# Altium schematic sheet P09 DDRA&B NOVTT.SchDoc
size 420 x 297 mm
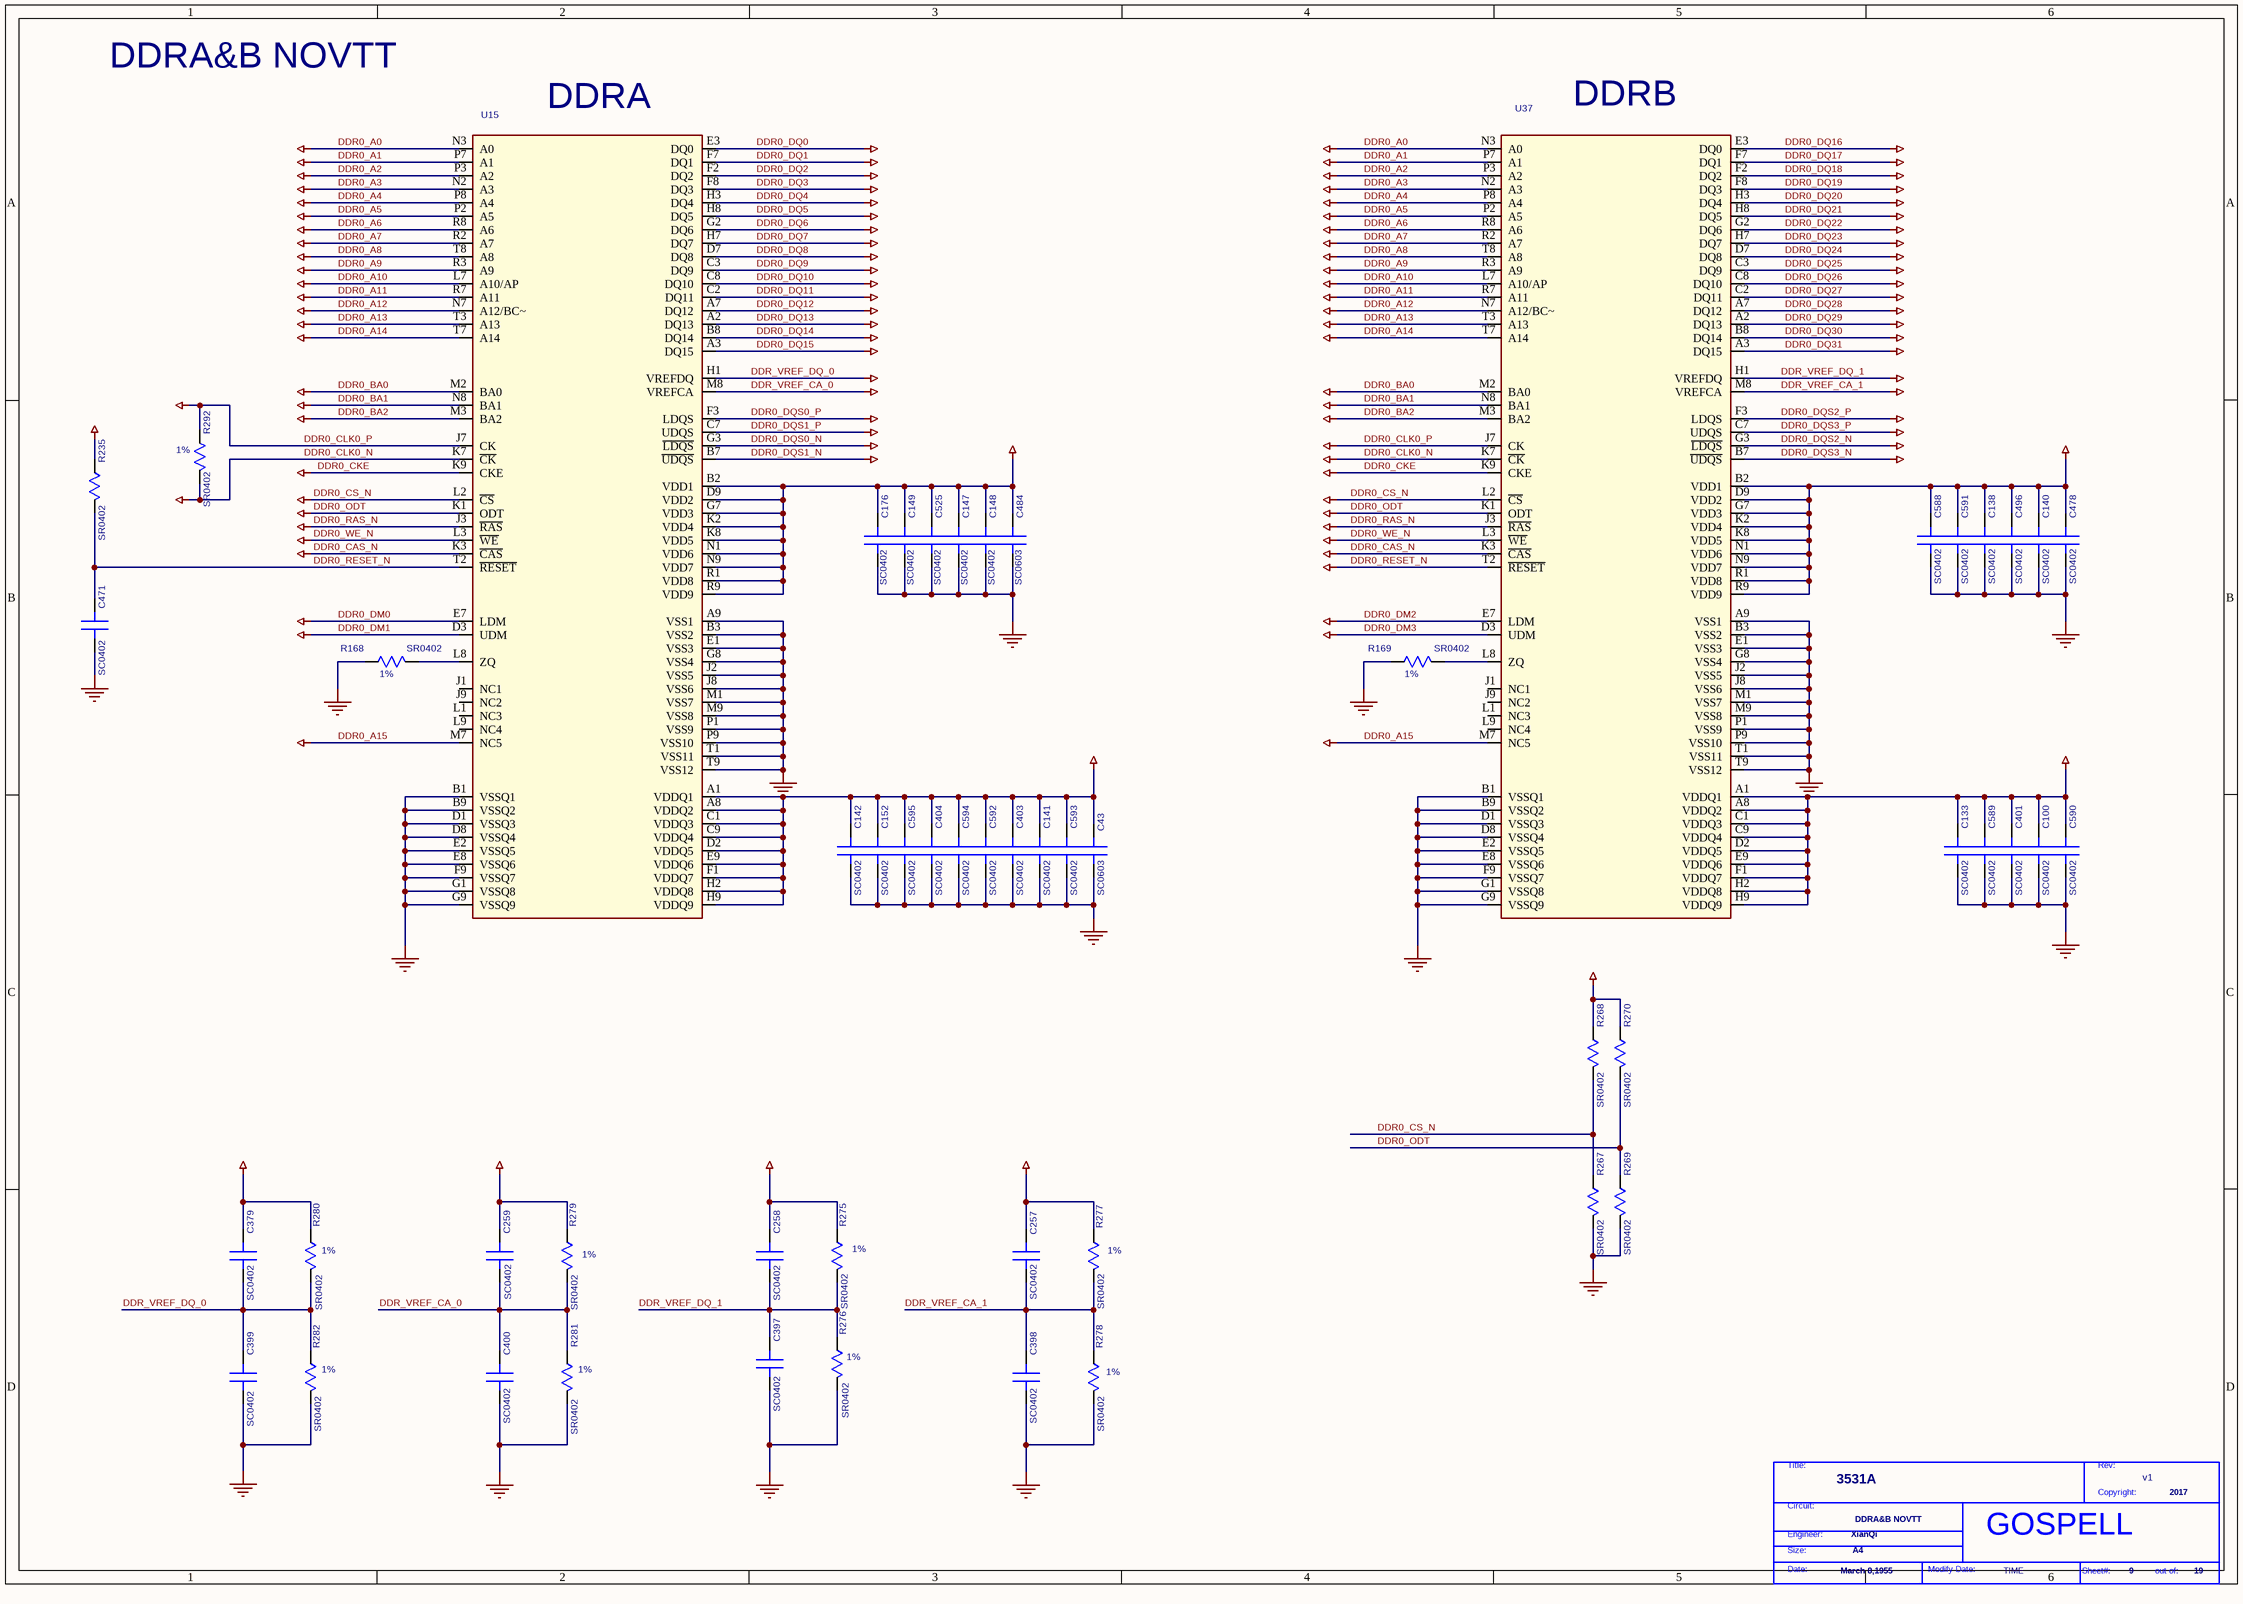
[diagram p0: P09 DDRA&B NOVTT.SchDoc]

## Parts
*  Page Modify Date: TIME  Engineer: XianQi  Copyright: 2017  Title: 3531A  RevCode: v1  Page Size: A4  Page Create Date: March 8,1955  Page Number: 9  Page Count: 19  Doc: DDRA&B NOVTT  (hidden comment: GOSPELL)  (graphical)
C43  SC0603  [SC0603]
C100  SC0402  [SC0402]
C133  SC0402  [SC0402]
C138  SC0402  [SC0402]
C140  SC0402  [SC0402]
C141  SC0402  [SC0402]
C142  SC0402  [SC0402]
C147  SC0402  [SC0402]
C148  SC0402  [SC0402]
C149  SC0402  [SC0402]
C152  SC0402  [SC0402]
C176  SC0402  [SC0402]
C257  SC0402  [SC0402]
C258  SC0402  [SC0402]
C259  SC0402  [SC0402]
C379  SC0402  [SC0402]
C397  SC0402  [SC0402]
C398  SC0402  [SC0402]
C399  SC0402  [SC0402]
C400  SC0402  [SC0402]
C401  SC0402  [SC0402]
C403  SC0402  [SC0402]
C404  SC0402  [SC0402]
C471  SC0402  [SC0402]
C478  SC0402  [SC0402]
C484  SC0603  [SC0603]
C496  SC0402  [SC0402]
C525  SC0402  [SC0402]
C588  SC0402  [SC0402]
C589  SC0402  [SC0402]
C590  SC0402  [SC0402]
C591  SC0402  [SC0402]
C592  SC0402  [SC0402]
C593  SC0402  [SC0402]
C594  SC0402  [SC0402]
C595  SC0402  [SC0402]
R168  SR0402  [SR0402]
R169  SR0402  [SR0402]
R235  SR0402  [SR0402]
R267  SR0402  [SR0402]
R268  SR0402  [SR0402]
R269  SR0402  [SR0402]
R270  SR0402  [SR0402]
R275  SR0402  [SR0402]
R276  SR0402  [SR0402]
R277  SR0402  [SR0402]
R278  SR0402  [SR0402]
R279  SR0402  [SR0402]
R280  SR0402  [SR0402]
R281  SR0402  [SR0402]
R282  SR0402  [SR0402]
R292  SR0402  [SR0402]
U15  BGA96-32-1609M  [BGA96-32-1609M]  (value not drawn)
U37  BGA96-32-1609M  [BGA96-32-1609M]  (value not drawn)

## Nets
1V5: C43.1(A) C100.1(A) C133.1(A) C138.1(A) C140.1(A) C141.1(A) C142.1(A) C147.1(A) C148.1(A) C149.1(A) C152.1(A) C176.1(A) C257.1(A) C258.1(A) C259.1(A) C379.1(A) C401.1(A) C403.1(A) C404.1(A) C478.1(A) C484.1(A) C496.1(A) C525.1(A) C588.1(A) C589.1(A) C590.1(A) C591.1(A) C592.1(A) C593.1(A) C594.1(A) C595.1(A) R235.1(A) R268.1(A) R270.1(A) R275.1(A) R277.1(A) R279.1(A) R280.1(A) U15.A1(VDDQ1) U15.A8(VDDQ2) U15.B2(VDD1) U15.C1(VDDQ3) U15.C9(VDDQ4) U15.D2(VDDQ5) U15.D9(VDD2) U15.E9(VDDQ6) U15.F1(VDDQ7) U15.G7(VDD3) U15.H2(VDDQ8) U15.H9(VDDQ9) U15.K2(VDD4) U15.K8(VDD5) U15.N1(VDD6) U15.N9(VDD7) U15.R1(VDD8) U15.R9(VDD9) U37.A1(VDDQ1) U37.A8(VDDQ2) U37.B2(VDD1) U37.C1(VDDQ3) U37.C9(VDDQ4) U37.D2(VDDQ5) U37.D9(VDD2) U37.E9(VDDQ6) U37.F1(VDDQ7) U37.G7(VDD3) U37.H2(VDDQ8) U37.H9(VDDQ9) U37.K2(VDD4) U37.K8(VDD5) U37.N1(VDD6) U37.N9(VDD7) U37.R1(VDD8) U37.R9(VDD9)
DDR0_A0: U15.N3(A0) U37.N3(A0)
DDR0_A1: U15.P7(A1) U37.P7(A1)
DDR0_A2: U15.P3(A2) U37.P3(A2)
DDR0_A3: U15.N2(A3) U37.N2(A3)
DDR0_A4: U15.P8(A4) U37.P8(A4)
DDR0_A5: U15.P2(A5) U37.P2(A5)
DDR0_A6: U15.R8(A6) U37.R8(A6)
DDR0_A7: U15.R2(A7) U37.R2(A7)
DDR0_A8: U15.T8(A8) U37.T8(A8)
DDR0_A9: U15.R3(A9) U37.R3(A9)
DDR0_A10: U15.L7(A10/AP) U37.L7(A10/AP)
DDR0_A11: U15.R7(A11) U37.R7(A11)
DDR0_A12: U15.N7(A12/BC~) U37.N7(A12/BC~)
DDR0_A13: U15.T3(A13) U37.T3(A13)
DDR0_A14: U15.T7(A14) U37.T7(A14)
DDR0_A15: U15.M7(NC5) U37.M7(NC5)
DDR0_BA0: U15.M2(BA0) U37.M2(BA0)
DDR0_BA1: U15.N8(BA1) U37.N8(BA1)
DDR0_BA2: U15.M3(BA2) U37.M3(BA2)
DDR0_CAS_N: U15.K3(~{CAS}) U37.K3(~{CAS})
DDR0_CKE: U15.K9(CKE) U37.K9(CKE)
DDR0_CLK0_N: R292.2(B) U15.K7(~{CK}) U37.K7(~{CK})
DDR0_CLK0_P: R292.1(A) U15.J7(CK) U37.J7(CK)
DDR0_CS_N: R267.1(A) R268.2(B) U15.L2(~{CS}) U37.L2(~{CS})
DDR0_DM0: U15.E7(LDM)
DDR0_DM1: U15.D3(UDM)
DDR0_DM2: U37.E7(LDM)
DDR0_DM3: U37.D3(UDM)
DDR0_DQ0: U15.E3(DQ0)
DDR0_DQ1: U15.F7(DQ1)
DDR0_DQ2: U15.F2(DQ2)
DDR0_DQ3: U15.F8(DQ3)
DDR0_DQ4: U15.H3(DQ4)
DDR0_DQ5: U15.H8(DQ5)
DDR0_DQ6: U15.G2(DQ6)
DDR0_DQ7: U15.H7(DQ7)
DDR0_DQ8: U15.D7(DQ8)
DDR0_DQ9: U15.C3(DQ9)
DDR0_DQ10: U15.C8(DQ10)
DDR0_DQ11: U15.C2(DQ11)
DDR0_DQ12: U15.A7(DQ12)
DDR0_DQ13: U15.A2(DQ13)
DDR0_DQ14: U15.B8(DQ14)
DDR0_DQ15: U15.A3(DQ15)
DDR0_DQ16: U37.E3(DQ0)
DDR0_DQ17: U37.F7(DQ1)
DDR0_DQ18: U37.F2(DQ2)
DDR0_DQ19: U37.F8(DQ3)
DDR0_DQ20: U37.H3(DQ4)
DDR0_DQ21: U37.H8(DQ5)
DDR0_DQ22: U37.G2(DQ6)
DDR0_DQ23: U37.H7(DQ7)
DDR0_DQ24: U37.D7(DQ8)
DDR0_DQ25: U37.C3(DQ9)
DDR0_DQ26: U37.C8(DQ10)
DDR0_DQ27: U37.C2(DQ11)
DDR0_DQ28: U37.A7(DQ12)
DDR0_DQ29: U37.A2(DQ13)
DDR0_DQ30: U37.B8(DQ14)
DDR0_DQ31: U37.A3(DQ15)
DDR0_DQS0_N: U15.G3(~{LDQS})
DDR0_DQS0_P: U15.F3(LDQS)
DDR0_DQS1_N: U15.B7(~{UDQS})
DDR0_DQS1_P: U15.C7(UDQS)
DDR0_DQS2_N: U37.G3(~{LDQS})
DDR0_DQS2_P: U37.F3(LDQS)
DDR0_DQS3_N: U37.B7(~{UDQS})
DDR0_DQS3_P: U37.C7(UDQS)
DDR0_ODT: R269.1(A) R270.2(B) U15.K1(ODT) U37.K1(ODT)
DDR0_RAS_N: U15.J3(~{RAS}) U37.J3(~{RAS})
DDR0_RESET_N: C471.1(A) R235.2(B) U15.T2(~{RESET}) U37.T2(~{RESET})
DDR0_WE_N: U15.L3(~{WE}) U37.L3(~{WE})
DDR_VREF_CA_0: C259.2(B) C400.1(A) R279.2(B) R281.1(A) U15.M8(VREFCA)
DDR_VREF_CA_1: C257.2(B) C398.1(A) R277.2(B) R278.1(A) U37.M8(VREFCA)
DDR_VREF_DQ_0: C379.2(B) C399.1(A) R280.2(B) R282.1(A) U15.H1(VREFDQ)
DDR_VREF_DQ_1: C258.2(B) C397.1(A) R275.2(B) R276.1(A) U37.H1(VREFDQ)
GND: C43.2(B) C100.2(B) C133.2(B) C138.2(B) C140.2(B) C141.2(B) C142.2(B) C147.2(B) C148.2(B) C149.2(B) C152.2(B) C176.2(B) C397.2(B) C398.2(B) C399.2(B) C400.2(B) C401.2(B) C403.2(B) C404.2(B) C471.2(B) C478.2(B) C484.2(B) C496.2(B) C525.2(B) C588.2(B) C589.2(B) C590.2(B) C591.2(B) C592.2(B) C593.2(B) C594.2(B) C595.2(B) R168.1(A) R169.1(A) R267.2(B) R269.2(B) R276.2(B) R278.2(B) R281.2(B) R282.2(B) U15.A9(VSS1) U15.B1(VSSQ1) U15.B3(VSS2) U15.B9(VSSQ2) U15.D1(VSSQ3) U15.D8(VSSQ4) U15.E1(VSS3) U15.E2(VSSQ5) U15.E8(VSSQ6) U15.F9(VSSQ7) U15.G1(VSSQ8) U15.G8(VSS4) U15.G9(VSSQ9) U15.J2(VSS5) U15.J8(VSS6) U15.M1(VSS7) U15.M9(VSS8) U15.P1(VSS9) U15.P9(VSS10) U15.T1(VSS11) U15.T9(VSS12) U37.A9(VSS1) U37.B1(VSSQ1) U37.B3(VSS2) U37.B9(VSSQ2) U37.D1(VSSQ3) U37.D8(VSSQ4) U37.E1(VSS3) U37.E2(VSSQ5) U37.E8(VSSQ6) U37.F9(VSSQ7) U37.G1(VSSQ8) U37.G8(VSS4) U37.G9(VSSQ9) U37.J2(VSS5) U37.J8(VSS6) U37.M1(VSS7) U37.M9(VSS8) U37.P1(VSS9) U37.P9(VSS10) U37.T1(VSS11) U37.T9(VSS12)
NetR168_2: R168.2(B) U15.L8(ZQ)
NetR169_2: R169.2(B) U37.L8(ZQ)

Not connected (* = marked no-connect by the designer): U15 J1(NC1) J9(NC2) L1(NC3) L9(NC4); U37 J1(NC1) J9(NC2) L1(NC3) L9(NC4)

## Notes on the sheet
- DDRA&B NOVTT
- (near U15) DDRA
- (near U37) DDRB
- (near R292) 1%
- (near R168) 1%
- (near R169) 1%
- (near R280) 1%
- (near R279) 1%
- (near R275) 1%
- (near R277) 1%
- (near R282) 1%
- (near R281) 1%
- (near R276) 1%
- (near R278) 1%
- (in symbol GOSPELL) Title:; Rev:; Copyright:; Circuit:; Engineer:; Size:; Date:; Modify Date:; Sheet#:; out of:

## Library data of the parts
C43 C484 = C_0_Dup2: PARTS: 1; PINSWAP: (A,B); LEVEL: STD; DEVICE: C1608X5R0J106MT0A0E; OriginalSymbolOrigin: (0,30); %208%%161%%192%%224%%195%%251%%179%%198%: SMD陶瓷电容; COMPONENT_HIGH_MAX: 0.9MM; %182%%238%%182%%168%%185%%164%%215%%247%%181%%231%%209%%185%(V): 6.3; %195%%232%%202%%246%: SMD陶瓷电容-6.3V-10000NF-+/-20%-X5R-0603-BT,TS16949; CODE: 8070649; PKG_TYPE: SC0603
C100 C147 = C_0_Dup2: PARTS: 1; PINSWAP: (A,B); LEVEL: STD; DEVICE: GRM155R60J474KE19D; OriginalSymbolOrigin: (0,30); CODE: 8070625; %195%%232%%202%%246%: SMD陶瓷电容-6.3V-470NF-+/-10%-X5R-0402; %182%%238%%182%%168%%185%%164%%215%%247%%181%%231%%209%%185%(V): 6.3; COMPONENT_HIGH_MAX: 0.55MM; %208%%161%%192%%224%%195%%251%%179%%198%: SMD陶瓷电容; PKG_TYPE: SC0402
C133 C142 C258 C379 C397 C398 C400 C401 C404 C591 C592 = C_0_Dup2: PARTS: 1; PINSWAP: (A,B); LEVEL: STD; DEVICE: RMEMK105BJ104KV_FR; OriginalSymbolOrigin: (0,30); CODE: 8070614; %195%%232%%202%%246%: SMD陶瓷电容-16V-100NF-+/-10%-X7R-0402-BT; %182%%238%%182%%168%%185%%164%%215%%247%%181%%231%%209%%185%(V): 16; COMPONENT_HIGH_MAX: 0.55MM; %208%%161%%192%%224%%195%%251%%179%%198%: SMD陶瓷电容; PKG_TYPE: SC0402
C138 C149 C152 C176 C257 C259 C399 C588 C589 C594 C595 = C_0_Dup2: PARTS: 1; PINSWAP: (A,B); LEVEL: STD; DEVICE: RMEMK105BJ104KV_FR; OriginalSymbolOrigin: (0,30); %208%%161%%192%%224%%195%%251%%179%%198%: SMD陶瓷电容; COMPONENT_HIGH_MAX: 0.55MM; %182%%238%%182%%168%%185%%164%%215%%247%%181%%231%%209%%185%(V): 16; %195%%232%%202%%246%: SMD陶瓷电容-16V-100NF-+/-10%-X7R-0402-BT; CODE: 8070614; PKG_TYPE: SC0402
C140 C141 C478 = C_0_Dup2: PARTS: 1; PINSWAP: (A,B); LEVEL: STD; DEVICE: CV05X5R105K10AH; OriginalSymbolOrigin: (0,30); CODE: 8070612; %195%%232%%202%%246%: SMD陶瓷电容-10V-1000NF-+/-10%-X5R-0402-BT,TS16949; %182%%238%%182%%168%%185%%164%%215%%247%%181%%231%%209%%185%(V): 10; COMPONENT_HIGH_MAX: 0.55MM; %208%%161%%192%%224%%195%%251%%179%%198%: SMD陶瓷电容; PKG_TYPE: SC0402
C148 C590 C593 = C_0_Dup2: PARTS: 1; PINSWAP: (A,B); LEVEL: STD; DEVICE: CV05X5R105K10AH; OriginalSymbolOrigin: (0,30); %208%%161%%192%%224%%195%%251%%179%%198%: SMD陶瓷电容; COMPONENT_HIGH_MAX: 0.55MM; %182%%238%%182%%168%%185%%164%%215%%247%%181%%231%%209%%185%(V): 10; %195%%232%%202%%246%: SMD陶瓷电容-10V-1000NF-+/-10%-X5R-0402-BT,TS16949; CODE: 8070612; PKG_TYPE: SC0402
C403 C496 C525 = C_0_Dup2: PARTS: 1; PINSWAP: (A,B); LEVEL: STD; DEVICE: GRM155R60J474KE19D; OriginalSymbolOrigin: (0,30); %208%%161%%192%%224%%195%%251%%179%%198%: SMD陶瓷电容; COMPONENT_HIGH_MAX: 0.55MM; %182%%238%%182%%168%%185%%164%%215%%247%%181%%231%%209%%185%(V): 6.3; %195%%232%%202%%246%: SMD陶瓷电容-6.3V-470NF-+/-10%-X5R-0402; CODE: 8070625; PKG_TYPE: SC0402
C471 = C_0_Dup2: PARTS: 1; PINSWAP: (A,B); LEVEL: STD; DEVICE: 04025C102KAT2A; OriginalSymbolOrigin: (0,30); %208%%161%%192%%224%%195%%251%%179%%198%: SMD陶瓷电容; COMPONENT_HIGH_MAX: 0.56MM; %182%%238%%182%%168%%185%%164%%215%%247%%181%%231%%209%%185%(V): 50; %195%%232%%202%%246%: SMD陶瓷电容-50V-1NF-+/-10%-X7R-0402-BT; CODE: 8070531; PKG_TYPE: SC0402
R168 = R_1: PARTS: 1; LEVEL: STD; DEVICE: RC0402FR_07240RL; PINSWAP: (A,B); OriginalSymbolOrigin: (10,20); %208%%161%%192%%224%%195%%251%%179%%198%: 片式厚膜电阻器; COMPONENT_HIGH_MAX: 0.4MM; %215%%232%%214%%181%%212%%202%%208%%237%%198%%171%%178%%238%: +/- 1%; %182%%238%%182%%168%%185%%166%%194%%202%(W): 0.06; %195%%232%%202%%246%: 片式厚膜电阻器-0.0625W-240OHM-+/- 1%-0402-BT; CODE: 7091782; PKG_TYPE: SR0402
R169 = R_1: PARTS: 1; LEVEL: STD; DEVICE: RC0402FR_07240RL; PINSWAP: (A,B); OriginalSymbolOrigin: (10,20); CODE: 7091782; %195%%232%%202%%246%: 片式厚膜电阻器-0.0625W-240OHM-+/- 1%-0402-BT; %182%%238%%182%%168%%185%%166%%194%%202%(W): 0.06; %215%%232%%214%%181%%212%%202%%208%%237%%198%%171%%178%%238%: +/- 1%; COMPONENT_HIGH_MAX: 0.4MM; %208%%161%%192%%224%%195%%251%%179%%198%: 片式厚膜电阻器; PKG_TYPE: SR0402
R235 = R_1: PARTS: 1; LEVEL: STD; DEVICE: RK73H1ETTP1002F; PINSWAP: (A,B); OriginalSymbolOrigin: (10,20); CODE: 7090867; %195%%232%%202%%246%: 片式厚膜电阻器-0.0625W-10000OHM-+/-1%-0402-BT; %182%%238%%182%%168%%185%%166%%194%%202%(W): 0.06; %215%%232%%214%%181%%212%%202%%208%%237%%198%%171%%178%%238%: +/-1%; COMPONENT_HIGH_MAX: 0.4MM; %208%%161%%192%%224%%195%%251%%179%%198%: 片式厚膜电阻器; PKG_TYPE: SR0402
R267 R270 = R_1: PARTS: 1; LEVEL: STD; DEVICE: RC0402JR_07100R; PINSWAP: (A,B); OriginalSymbolOrigin: (10,20); %208%%161%%192%%224%%195%%251%%179%%198%: 片式厚膜电阻器; COMPONENT_HIGH_MAX: 0.4MM; %215%%232%%214%%181%%212%%202%%208%%237%%198%%171%%178%%238%: +/-5%; %182%%238%%182%%168%%185%%166%%194%%202%(W): 0.06; %195%%232%%202%%246%: 片式厚膜电阻器-0.0625W-100OHM-+/-5%-0402-BT; CODE: 7090807; PKG_TYPE: SR0402
R268 R269 = R_1: PARTS: 1; LEVEL: STD; DEVICE: RC0402JR_07100R; PINSWAP: (A,B); OriginalSymbolOrigin: (10,20); CODE: 7090807; %195%%232%%202%%246%: 片式厚膜电阻器-0.0625W-100OHM-+/-5%-0402-BT; %182%%238%%182%%168%%185%%166%%194%%202%(W): 0.06; %215%%232%%214%%181%%212%%202%%208%%237%%198%%171%%178%%238%: +/-5%; COMPONENT_HIGH_MAX: 0.4MM; %208%%161%%192%%224%%195%%251%%179%%198%: 片式厚膜电阻器; PKG_TYPE: SR0402
R275 R278 R280-R282 = R_1: PARTS: 1; LEVEL: STD; DEVICE: RC0402FR_071KL; PINSWAP: (A,B); OriginalSymbolOrigin: (10,20); %208%%161%%192%%224%%195%%251%%179%%198%: 片式厚膜电阻器; COMPONENT_HIGH_MAX: 0.4MM; %215%%232%%214%%181%%212%%202%%208%%237%%198%%171%%178%%238%: +/-1%; %182%%238%%182%%168%%185%%166%%194%%202%(W): 0.06; %195%%232%%202%%246%: 片式厚膜电阻器-0.0625W-1000OHM-+/-1%-0402-BT; CODE: 7091282; PKG_TYPE: SR0402
R276 R277 R279 = R_1: PARTS: 1; LEVEL: STD; DEVICE: RC0402FR_071KL; PINSWAP: (A,B); OriginalSymbolOrigin: (10,20); CODE: 7091282; %195%%232%%202%%246%: 片式厚膜电阻器-0.0625W-1000OHM-+/-1%-0402-BT; %182%%238%%182%%168%%185%%166%%194%%202%(W): 0.06; %215%%232%%214%%181%%212%%202%%208%%237%%198%%171%%178%%238%: +/-1%; COMPONENT_HIGH_MAX: 0.4MM; %208%%161%%192%%224%%195%%251%%179%%198%: 片式厚膜电阻器; PKG_TYPE: SR0402
R292 = R_1: PARTS: 1; LEVEL: STD; DEVICE: RC_02W69R8FT; PINSWAP: (A,B); OriginalSymbolOrigin: (10,20); %208%%161%%192%%224%%195%%251%%179%%198%: 片式厚膜电阻器; COMPONENT_HIGH_MAX: 0.4MM; %215%%232%%214%%181%%212%%202%%208%%237%%198%%171%%178%%238%: +/-1%; %182%%238%%182%%168%%185%%166%%194%%202%(W): 0.06; %195%%232%%202%%246%: 片式厚膜电阻器-0.0625W-69.8OHM-+/-1%-0402; CODE: 7091319; PKG_TYPE: SR0402
U15 = MT41J256M16RE-15E-D_2: PARTS: 1; DEVICE: H5TQ4G63AFR_RDC; LEVEL: STD; OriginalSymbolOrigin: (10,590); COMPONENT_HIGH_MAX: 1.2MM; %195%%232%%202%%246%: DDR3 DRAM-4GBIT-933MHZ-16BIT-1.5V-FBGA96(无铅)-终端专用-00777465; CODE: 40020344; PKG_TYPE: BGA96-32-1609M
U37 = MT41J256M16RE-15E-D_2: PARTS: 1; DEVICE: H5TQ4G63AFR_RDC; LEVEL: STD; OriginalSymbolOrigin: (10,590); CODE: 40020344; %195%%232%%202%%246%: DDR3 DRAM-4GBIT-933MHZ-16BIT-1.5V-FBGA96(无铅)-终端专用-00777465; COMPONENT_HIGH_MAX: 1.2MM; PKG_TYPE: BGA96-32-1609M